# Altium schematic sheet FOTA Burn Buffer.SchDoc: FOTA Burn Buffer
size 292 x 193 mm; DocumentNumber: 19; SheetNumber: 25; SheetTotal: 28
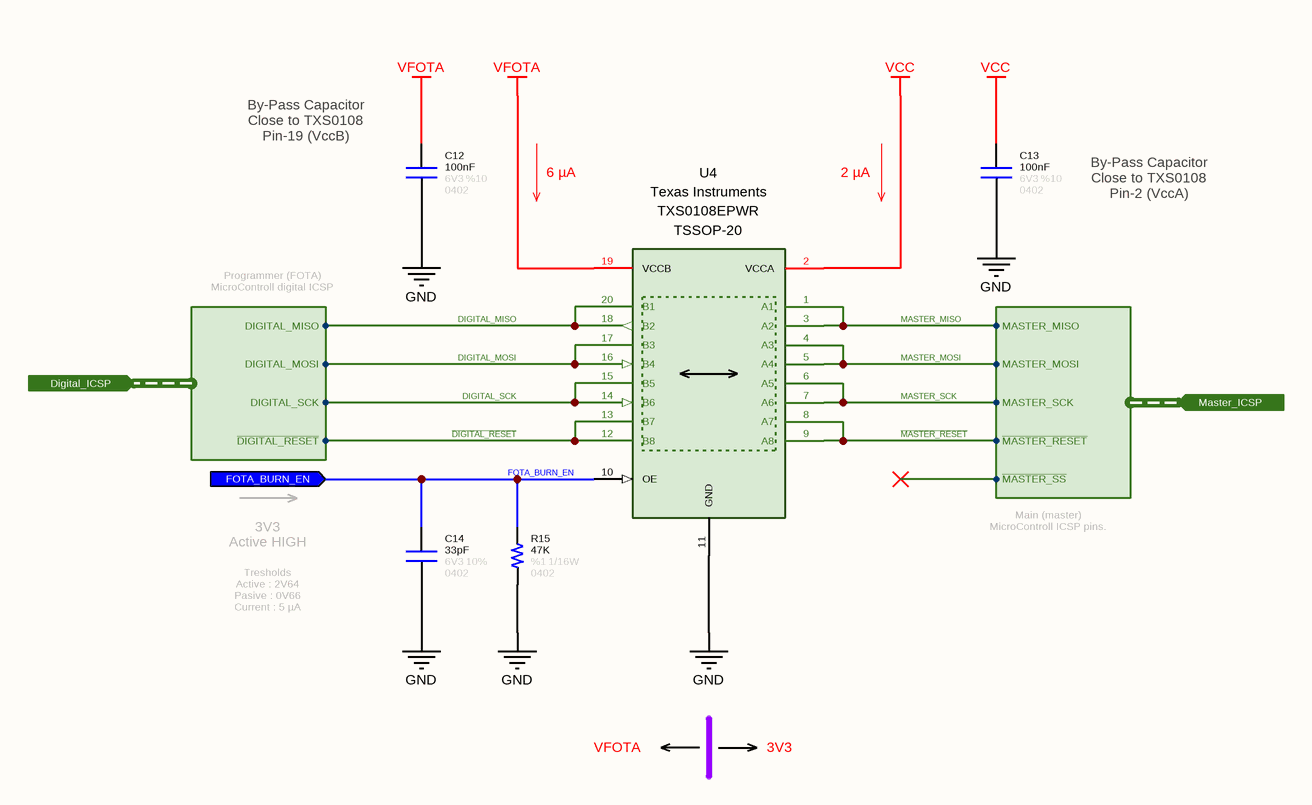
[diagram p0: FOTA Burn Buffer.SchDoc]

## Parts
C12  value 100nF  Tolerance: %10  Voltage: 6V3  Case: 0402  [CAPACITOR_0402]  (hidden comment: Capacitor - 100nF [0402] (Ceramic))
C13  value 100nF  Tolerance: %10  Voltage: 6V3  Case: 0402  [CAPACITOR_0402]  (hidden comment: Capacitor - 100nF [0402] (Ceramic))
C14  value 33pF  Tolerance: 10%  Case: 0402  Voltage: 6V3  [CAPACITOR_0402]  (hidden comment: Capacitor - 33pF [0402] (Ceramic))
R15  value 47K  Tolerance: %1  Case: 0402  Power: 1/16W  [RESISTOR_0402]  (hidden comment: 47K - 0402 - %1 - 1/16W)
U4  Manufacturer Name: Texas Instruments  [TSSOP-20]  (hidden comment: TXS0108EPWR)

## Ports
Digital_ICSP (in, harness Digital_ICSP), FOTA_BURN_EN (in), Master_ICSP (in, harness Master_ICSP)

## Harnesses
Master_ICSP: MASTER_MOSI, MASTER_MISO, MASTER_SCK, ~{MASTER_RESET}, ~{MASTER_SS}
Digital_ICSP: ~{DIGITAL_RESET}, DIGITAL_SCK, DIGITAL_MOSI, DIGITAL_MISO

## Nets
GND: C12.1 C13.1 C14.1 R15.1 U4.11(GND)
VCC: C13.2 U4.2(VCCA)
VFOTA: C12.2 U4.19(VCCB)
~{DIGITAL_RESET}: U4.12(B8) U4.13(B7) ; port Digital_ICSP.~{DIGITAL_RESET}
DIGITAL_MISO: U4.18(B2) U4.20(B1) ; port Digital_ICSP.DIGITAL_MISO
DIGITAL_MOSI: U4.16(B4) U4.17(B3) ; port Digital_ICSP.DIGITAL_MOSI
DIGITAL_SCK: U4.14(B6) U4.15(B5) ; port Digital_ICSP.DIGITAL_SCK
FOTA_BURN_EN: C14.2 R15.2 U4.10(OE) ; port FOTA_BURN_EN
~{MASTER_RESET}: U4.8(A7) U4.9(A8) ; port Master_ICSP.~{MASTER_RESET}
MASTER_MISO: U4.1(A1) U4.3(A2) ; port Master_ICSP.MASTER_MISO
MASTER_MOSI: U4.4(A3) U4.5(A4) ; port Master_ICSP.MASTER_MOSI
MASTER_SCK: U4.6(A5) U4.7(A6) ; port Master_ICSP.MASTER_SCK

## Notes on the sheet
- (near C12) By-Pass Capacitor
  Close to TXS0108
  Pin-19 (VccB)
- 6 µA
- 2 µA
- By-Pass Capacitor
  Close to TXS0108
  Pin-2 (VccA)
- Programmer (FOTA) MicroControll digital ICSP pins.
- 3V3
  Active HIGH
- Main (master) MicroControll ICSP pins.
- Tresholds
  Active : 2V64
  Pasive : 0V66
  Current : 5 µA
- VFOTA
- 3V3
- © 2021 All rights reserved.
  This document may not, in whole or in part, be copied, photocopied, reproduced, translated or converted to any electronic or machine readable from without prior written permission of Mehmet Günce Akkoyun.
  Engineer contact : akkoyun@me.com
- Property of
- Engineer :
- Date :
- Size :
- A4
- Time :
- Project :
- Page :
- /
- Customer :
- Product ID :
- Module ID :
- Version :
- File :
- Revision :

## Library data of the parts
C12 C13 = Capacitor - 100nF [0402-6V3]: Capacitor - 100nF [0402-6V3] (Ceramic); Manufacturer Name: AVX; Manufacturer Part Number: 04026D104KAT4A; ComponentLink1Description: Mouser; ComponentLink1URL: https://www.mouser.com.tr/ProductDetail/AVX/04026D104KAT4A?qs=sGAEpiMZZMs0AnBnWHyRQPg4iYkCw7IMED%2F4kpqgf7w%3D; ComponentLink2Description: DataSheet; ComponentLink2URL: https://www.mouser.com.tr/datasheet/2/40/cx5r-776519.pdf
C14 = Capacitor - 33pF [0402-6V3]: Manufacturer Name: Kemet; Manufacturer Part Number: C0402C330J9RACAUTO; ComponentLink1Description: DataSheet; ComponentLink1URL: https://api.kemet.com/component-edge/download/datasheet/C0402C330J9RACAUTO.pdf; ComponentLink2Description: Mouser; ComponentLink2URL: https://www.mouser.com/Search/Refine.aspx?Keyword=80-C0402C330J9RAUTO
R15 = Resistor - 47K [0402]: Thick Film Resistors - SMD 1/16 W 47 KOhm 1%; Manufacturer Name: Vishay; Manufacturer Part Number: CRCW040247K0FKED; ComponentLink1Description: DataSheet; ComponentLink1URL: https://www.mouser.com.tr/datasheet/2/427/dcrcwe3-1762152.pdf; ComponentLink2Description: Mouser; ComponentLink2URL: https://www.mouser.com.tr/ProductDetail/Vishay-Dale/CRCW040247K0FKED?qs=sGAEpiMZZMu61qfTUdNhG2DpbjADlD3GL%252B3h1elTxqU%3D
U4 = IC - TXS0108: IC 8BIT NON-INV TRANSLTR 20TSSOP; Supply Voltage - Max: 5.5 V; Supply Voltage - Min: 1.2 V, 1.65 V; High Level Output Current: 50 mA; Data Rate: 60 Mb/s; RoHS: Yes; Product Type: Translation ICs; Minimum Operating Temperature: - 40 C; Low Level Output Current: 50 mA; Maximum Operating Temperature: + 85 C; Manufacturer Part Number: TXS0108EPWR; Case: TSSOP-20